# Altium schematic sheet TEMP_MGT.SchDoc
size A4
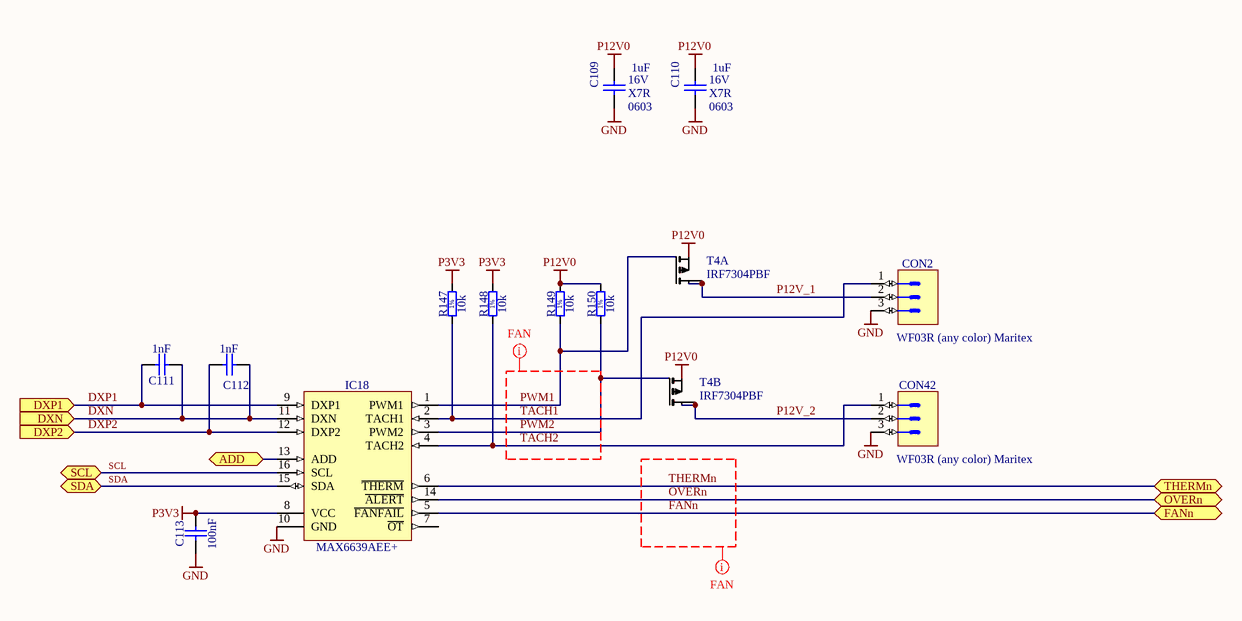
[diagram p0: TEMP_MGT.SchDoc]

## Parts
C109  1uF  Voltage: 16V  TC: X7R  Case: 0603  [CAPC1608X87N]
C110  1uF  Voltage: 16V  TC: X7R  Case: 0603  [CAPC1608X87N]
C111  1nF  [CAPC1608X87N]
C112  1nF  [CAPC1608X87N]
C113  100nF  [CAPC0603X33N]
CON2  WF03R (any color) Maritex  [MOLEX_22-05-7038]
CON42  WF03R (any color) Maritex  [MOLEX_22-05-7038]
IC18  MAX6639AEE+  [SOP63P600X175-16N]
R147  10k  [RESC1005X40N]
R148  10k  [RESC1005X40N]
R149  10k  [RESC1005X40N]
R150  10k  [RESC1005X40N]
T4  IRF7304PBF  [so-8]  (parts A,B of 2)

## Ports
ADD (bidir), DXN (in), DXP1 (in), DXP2 (in), FANn (bidir), OVERn (bidir), SCL (bidir), SDA (bidir), THERMn (bidir)

## Nets
GND: C109.1 C110.1 C113.1 CON2.3 CON42.3 IC18.10(GND)
P3V3: C113.2 IC18.8(VCC) R147.2 R148.2
P12V0: C109.2 C110.2 R149.2 R150.2 T4.1(S1) T4.3(S2)
ADD: IC18.13(ADD) ; port ADD
DXN: C111.1 C112.1 IC18.11(DXN) ; port DXN
DXP1: C111.2 IC18.9(DXP1) ; port DXP1
DXP2: C112.2 IC18.12(DXP2) ; port DXP2
FANn: IC18.5(~{FANFAIL}) ; port FANn
OVERn: IC18.14(~{ALERT}) ; port OVERn
P12V_1: CON2.2 T4.7(D1) T4.8(D1)
P12V_2: CON42.2 T4.5(D2) T4.6(D2)
PWM1: IC18.1(PWM1) R149.1 T4.2(G1)
PWM2: IC18.3(PWM2) R150.1 T4.4(G2)
SCL: IC18.16(SCL) ; port SCL
SDA: IC18.15(SDA) ; port SDA
TACH1: CON2.1 IC18.2(TACH1) R147.1
TACH2: CON42.1 IC18.4(TACH2) R148.1
THERMn: IC18.6(~{THERM}) ; port THERMn

Not connected (* = marked no-connect by the designer): IC18 7(~{OT})

## Layout directives
net class FAN: FANn, OVERn, PWM1, PWM2, TACH1, TACH2, THERMn

## Notes on the sheet
- (in symbol R0402_10K_1%_0.0625W_100PPM) 1%

## Library data of the parts
C109 C110 = CC0603_1UF_16V_10%_X7R: Non-polarised capacitor; Part Description: SMD Multilayer Chip Ceramic Capacitor; Manufacturer: GENERIC; Manufacturer1 Part Number: 223824613663; Tolerance: ±10%; Table: Capacitors SMD; Part Number: CC0603_1UF_16V_10%_X7R; Component Kind: Standard; Component Type: Standard; Pin Count: 2; Value: 1uF; Status: Preferred; Manufacturer Part Number: CC0603_1uF_16V_10%_X7R; Mounted: Yes; Socket: No; SMD: Yes; Manufacturer1 Example: PHYCOMP; Manufacturer1 ComponentHeight: 0.87mm; HelpURL: \\cern.ch\dfs\Applications\Altium\Datasheets\CC0805_X5R_PHYCOMP_HC.pdf; Author: CERN DEM JLC; CreateDate: 12/3/2007; LatestRevisionDate: 12/3/2007
C111 C112 = CC0603_1NF_50V_10%_X7R: Non-polarised capacitor; Part Description: SMD Multilayer Chip Ceramic Capacitor; Manufacturer: GENERIC; Manufacturer1 Part Number: 223858615623; Voltage: 50V; TC: X7R; Tolerance: ±10%; Table: Capacitors SMD; Part Number: CC0603_1NF_50V_10%_X7R; Component Kind: Standard; Component Type: Standard; Pin Count: 2; Value: 1nF; Status: Preferred; Manufacturer Part Number: CC0603_1NF_50V_10%_X7R; Case: 0603; Mounted: Yes; Socket: No; SMD: Yes; Manufacturer1 Example: PHYCOMP; Manufacturer1 ComponentHeight: 0.87mm; HelpURL: \\cern.ch\dfs\Applications\Altium\Datasheets\CC0603_X7R_PHYCOMP.pdf; Author: CERN DEM JLC; CreateDate: 2007-12-03; LatestRevisionDate: 2007-12-03
C113 = CC0201_100NF_6.3V_10%_X5R: Non-polarised capacitor; Part Description: SMD Multilayer Chip Ceramic Capacitor; Manufacturer: GENERIC; Manufacturer1 Part Number: 02016D104KAT2A; Voltage: 6.3V; TC: X5R; Tolerance: ±10%; Table: Capacitors SMD; Part Number: CC0201_100NF_6.3V_10%_X5R; Component Kind: Standard; Component Type: Standard; Pin Count: 2; Value: 100nF; Status: Not Recommended; Manufacturer Part Number: CC0201_100NF_6.3V_10%_X5R; Case: 0201; Mounted: Yes; Socket: No; SMD: Yes; Manufacturer1 Example: AVX; Manufacturer1 ComponentHeight: 0.33mm; HelpURL: \\cern.ch\dfs\Applications\Altium\Datasheets\CC0201_X5R_AVX.pdf; Author: CERN DEM JLC; CreateDate: 2007-12-03; LatestRevisionDate: 2007-12-03
CON2 CON42 = MOLEX_22-05-7038: Connector 3 Male; Part Description: 2.54mm (.100") Pitch KK® Wire-To-Board Header, Right Angle, With Friction Lock, 3 Circuits; Manufacturer: MOLEX; Part Number: MOLEX_22-05-7038; Component Kind: Standard; Component Type: Standard; Pin Count: 3; Family: KK®; Mounted: Yes; Socket: No; SMD: No; Status: None; Manufacturer Part Number: 22-05-7038; ComponentHeight: 5.8mm; HelpURL: \\cern.ch\dfs\Applications\Altium\Datasheets\MOLEX_22-05-7038.pdf; Author: CERN DEM JLC; CreateDate: 2012-09-19; LatestRevisionDate: 2012-09-19; Table: MOLEX
IC18 = MAX6639AEE+: 2-Channel Temperature Monitor with Dual, Automatic, PWM Fan-Speed Controller; Manufacturer: MAXIM; Table: Analog & Interface; Part Number: MAX6639AEE+; Component Kind: Standard; Component Type: Standard; Device: MAX6639AEE+; PackageDescription: SOP, 0.635mm pitch; 16 pin, 3.9mm W X 4.895mm L X 1.75mm H Body, IPC Medium Density; Part Description: 2-Channel Temperature Monitor with Dual, Automatic, PWM Fan-Speed Controller; Manufacturer Part Number: MAX6639AEE+; Pin Count: 16; Case: SSOP16; Mounted: Yes; Socket: No; SMD: Yes; ComponentHeight: 1.75mm; Author: CERN DEM JLC; HelpURL: \\cern.ch\dfs\Applications\Altium\Datasheets\MAX6639AEE+.pdf; CreateDate: 2012-08-15; LatestRevisionDate: 2012-08-15
R147-R150 = R0402_10K_1%_0.0625W_100PPM: Resistor - 1%; Part Description: General Purpose Thick Film Chip Resistor; Manufacturer: GENERIC; Manufacturer1 Part Number: 232270671003L; TC: ±100ppm/°C; Table: Resistors SMD; Part Number: R0402_10K_1%_0.0625W_100PPM; Component Kind: Standard; Component Type: Standard; Pin Count: 2; Value: 10k; Status: Not recommended; Power: 0.0625W; Tolerance: ±1%; Manufacturer Part Number: R0402_10K_1%_0.0625W_100PPM; Case: 0402; Mounted: Yes; Socket: No; SMD: Yes; Manufacturer1 Example: YAGEO PHYCOMP; Manufacturer1 ComponentHeight: 0.4mm; HelpURL: \\cern.ch\dfs\Applications\Altium\Datasheets\R0402_Phycomp_RC0402.pdf; Author: CERN DEM JLC; CreateDate: 2007-12-03; LatestRevisionDate: 2012-10-17
T4 = Q_IRF7304: dual PMOS   20V 4,3A 2,0W 0,09R